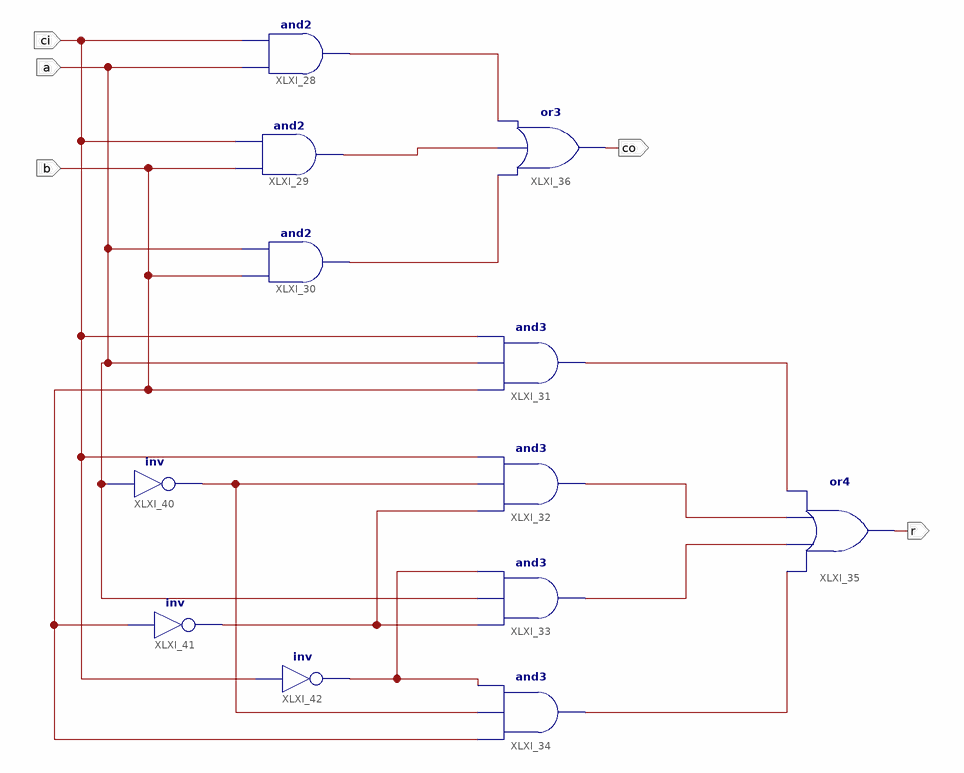
[diagram p0: schematic sheet 1]
// Xilinx ISE schematic add1b.sch (spartan3e) as structural Verilog: 12 symbols, 5 ports
module add1b (
  input  ci,
  input  b,
  input  a,
  output r,
  output co
);

  wire XLXN_89, XLXN_90, XLXN_91, XLXN_92, XLXN_93, XLXN_94, XLXN_95, XLXN_96, XLXN_97, XLXN_98;

  and XLXI_28 (XLXN_92, a, ci);
  and XLXI_29 (XLXN_93, b, ci);
  and XLXI_30 (XLXN_94, b, a);
  and XLXI_31 (XLXN_95, b, a, ci);
  and XLXI_32 (XLXN_96, XLXN_90, XLXN_89, ci);
  and XLXI_33 (XLXN_97, XLXN_90, a, XLXN_91);
  and XLXI_34 (XLXN_98, b, XLXN_89, XLXN_91);
  or XLXI_35 (r, XLXN_98, XLXN_97, XLXN_96, XLXN_95);
  or XLXI_36 (co, XLXN_94, XLXN_93, XLXN_92);
  not XLXI_42 (XLXN_91, ci);
  not XLXI_40 (XLXN_89, a);
  not XLXI_41 (XLXN_90, b);
endmodule
